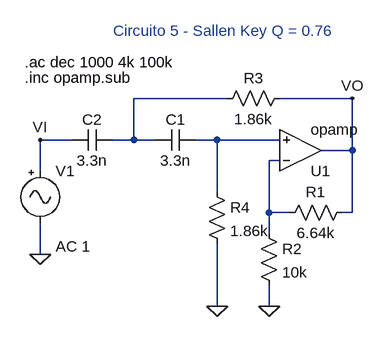
[diagram p0: schematic Circuito5.asc]
Circuito5.asc, the LTspice schematic file:
Version 4
SHEET 1 880 680
WIRE 112 80 -32 80
WIRE 304 80 192 80
WIRE -128 144 -176 144
WIRE -32 144 -32 80
WIRE -32 144 -64 144
WIRE 0 144 -32 144
WIRE 96 144 64 144
WIRE 192 144 96 144
WIRE 304 160 304 80
WIRE 304 160 256 160
WIRE 192 176 176 176
WIRE -176 192 -176 144
WIRE 96 224 96 144
WIRE 176 256 176 176
WIRE 208 256 176 256
WIRE 304 256 304 160
WIRE 304 256 288 256
WIRE 176 288 176 256
WIRE -176 320 -176 272
WIRE 96 400 96 304
WIRE 176 400 176 368
FLAG 176 400 0
FLAG 96 400 0
FLAG 304 80 VO
FLAG -176 320 0
FLAG -176 144 VI
SYMBOL Opamps\\opamp 224 224 M180
SYMATTR InstName U1
SYMBOL cap 64 128 R90
WINDOW 0 0 32 VBottom 2
WINDOW 3 32 32 VTop 2
SYMATTR InstName C1
SYMATTR Value 3.3n
SYMBOL cap -64 128 R90
WINDOW 0 0 32 VBottom 2
WINDOW 3 32 32 VTop 2
SYMATTR InstName C2
SYMATTR Value 3.3n
SYMBOL res 304 240 R90
WINDOW 0 0 56 VBottom 2
WINDOW 3 32 56 VTop 2
SYMATTR InstName R1
SYMATTR Value 6.64k
SYMBOL res 160 272 R0
SYMATTR InstName R2
SYMATTR Value 10k
SYMBOL res 208 64 R90
WINDOW 0 0 56 VBottom 2
WINDOW 3 32 56 VTop 2
SYMATTR InstName R3
SYMATTR Value 1.86k
SYMBOL res 80 208 R0
SYMATTR InstName R4
SYMATTR Value 1.86k
SYMBOL Misc\\signal -176 176 R0
WINDOW 123 24 132 Left 2
WINDOW 39 0 0 Left 2
SYMATTR Value2 AC 1
SYMATTR InstName V1
SYMATTR Value ""
TEXT -200 48 Left 2 !.inc opamp.sub
TEXT -200 24 Left 2 !.ac dec 1000 4k 100k
TEXT -64 -24 Left 2 ;Circuito 5 - Sallen Key Q = 0.76

The netlist it stands for:
* Circuito5.asc
XU1 N003 N002 VO opamp Aol=100K GBW=10Meg  ; pins invin noninvin out
C1 N002 N001 3.3n
C2 N001 VI 3.3n
R1 VO N003 6.64k
R2 N003 0 10k
R3 VO N001 1.86k
R4 N002 0 1.86k
V1 VI 0 AC 1
.inc opamp.sub
.ac dec 1000 4k 100k
* Circuito 5 - Sallen Key Q = 0.76
.backanno
.end